# EAGLE design Adafruit-FONA-800-GSM-Breakout (EAGLE 7.5.0)
COMPANY: ADAFRUIT INDUSTRIES; DRAWN: KTOWN; REV: C

## Sheet 1 of 2
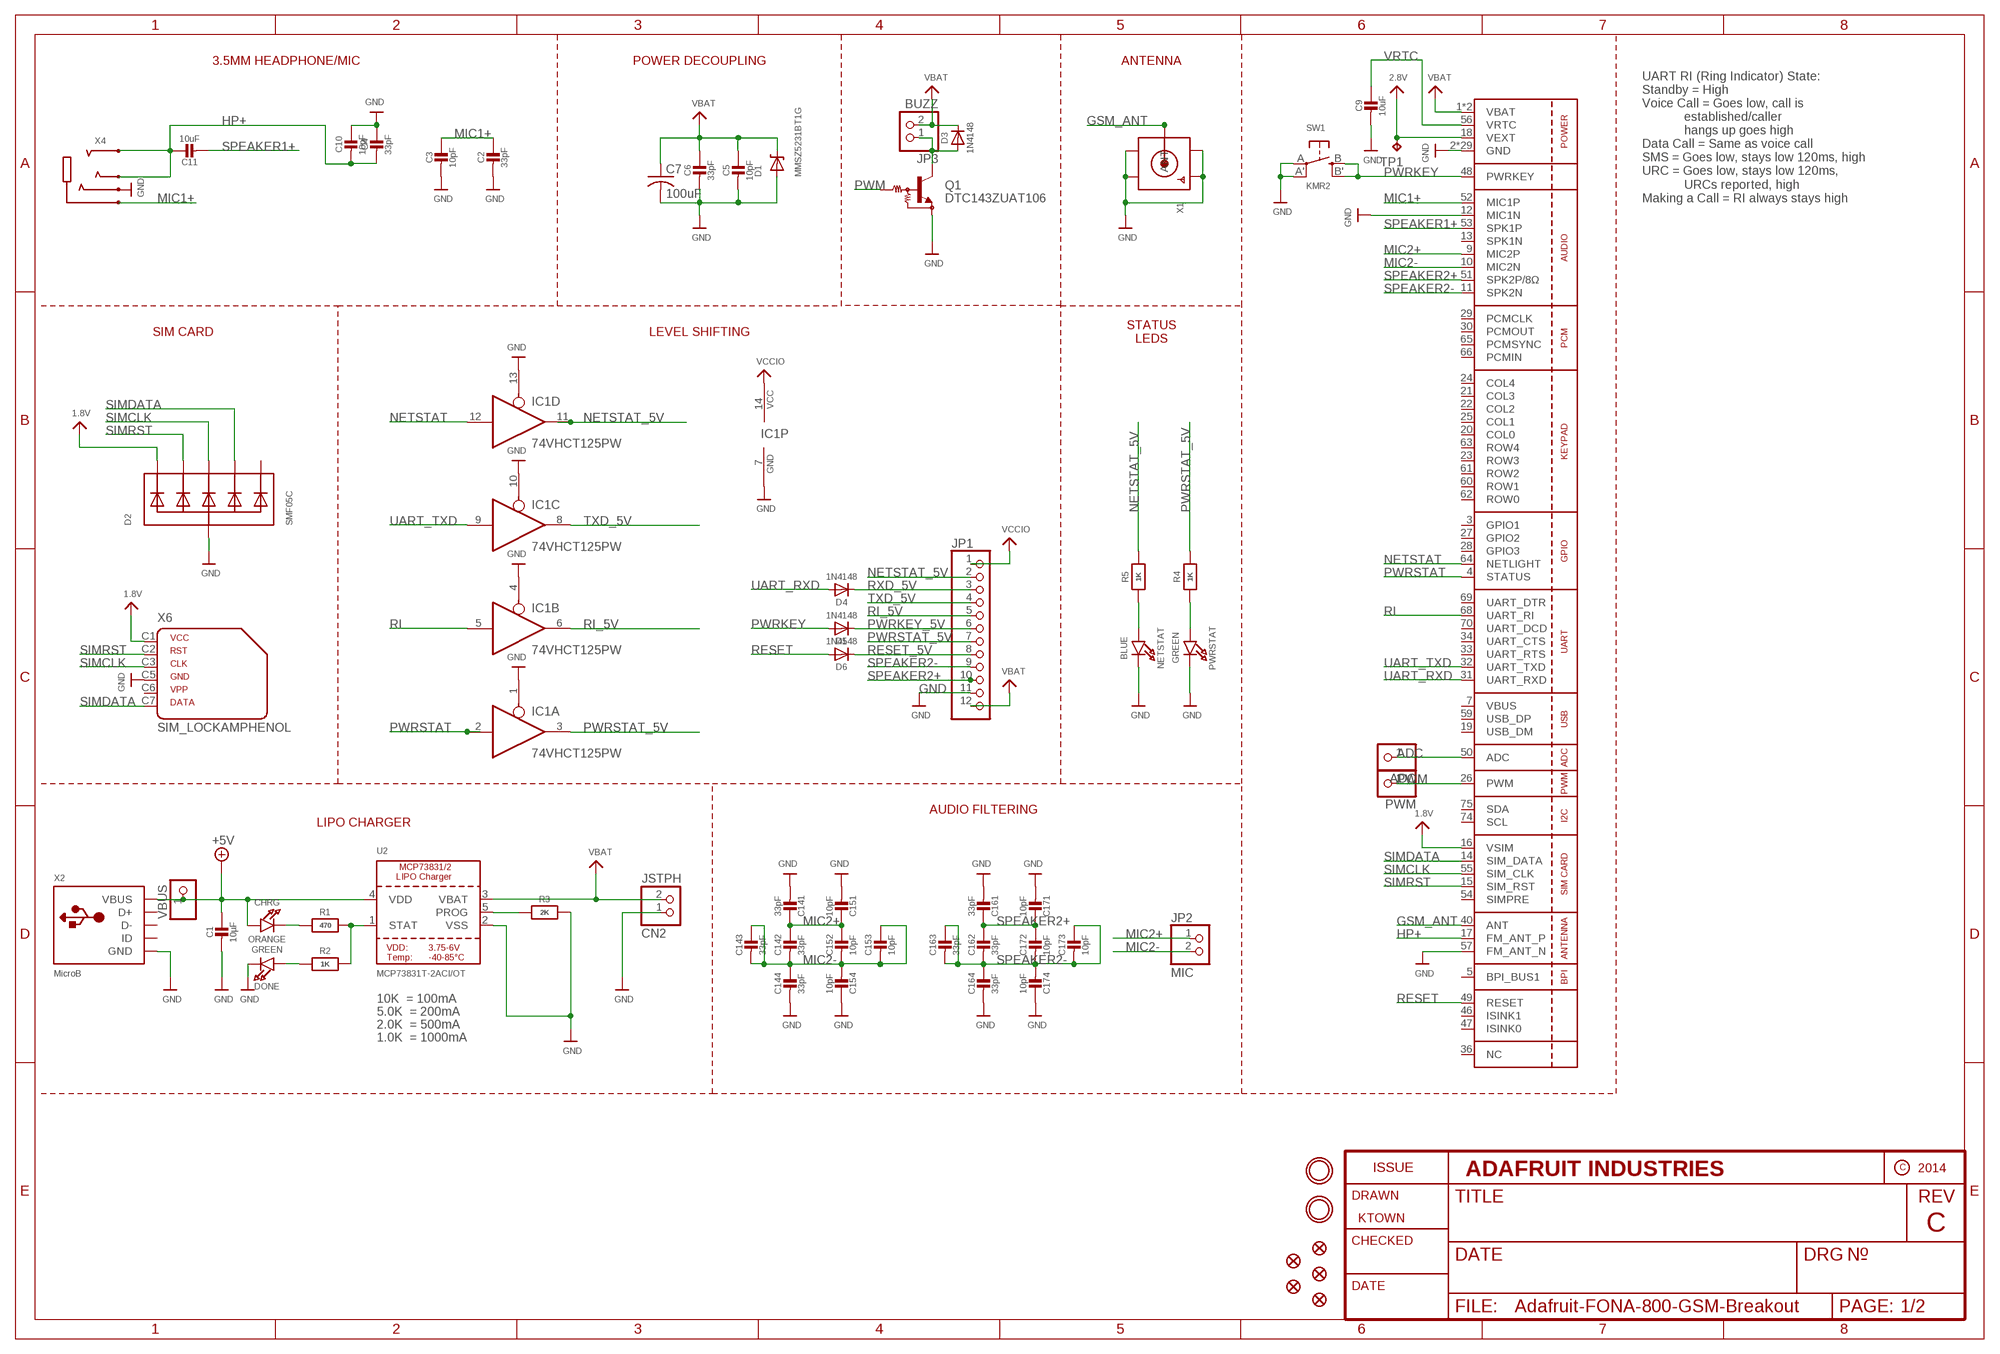
[diagram p0: schematic, sheet 1]

### Parts
ADC  PINHD-1X1CB  [1X01-CLEANBIG]
C1  10µF  CAP_CERAMIC0805-NOOUTLINE  [0805-NO]
C2  33pF  CAP_CERAMIC0805-NOOUTLINE  [0805-NO]
C3  10pF  CAP_CERAMIC0805-NOOUTLINE  [0805-NO]
C4  33pF  CAP_CERAMIC0805-NOOUTLINE  [0805-NO]
C5  10pF  CAP_CERAMIC0805-NOOUTLINE  [0805-NO]
C6  33pF  CAP_CERAMIC0805-NOOUTLINE  [0805-NO]
C7  100uF  C-USC1210  [C1210]
C9  10uF  CAP_CERAMIC0805-NOOUTLINE  [0805-NO]
C10  10pF  CAP_CERAMIC0805-NOOUTLINE  [0805-NO]
C11  10uF  CAP_CERAMIC0805-NOOUTLINE  [0805-NO]
C14  33pF  CAP_4PACK1206  [RESPACK_4X0603]
C15  10pF  CAP_4PACK1206  [RESPACK_4X0603]
C16  33pF  CAP_4PACK1206  [RESPACK_4X0603]
C17  10pF  CAP_4PACK1206  [RESPACK_4X0603]
CHRG  ORANGE  LED0805_NOOUTLINE  [CHIPLED_0805_NOOUTLINE]
CN2  JSTPH  JST_2PIN  [JSTPH2]
D1  MMSZ5231BT1G  DIODE-ZENERSOD123  [SOD-123]
D2  SMF05C  TVSARRAY_5LANE  [SOT363]
D3  1N4148  DIODESOD-323  [SOD-323]
D4  1N4148  DIODESOD-323  [SOD-323]
D5  1N4148  DIODESOD-323  [SOD-323]
D6  1N4148  DIODESOD-323  [SOD-323]
DONE  GREEN  LED0805_NOOUTLINE  [CHIPLED_0805_NOOUTLINE]
FID1  FIDUCIAL""  [FIDUCIAL_1MM]
FID2  FIDUCIAL""  [FIDUCIAL_1MM]
FID3  FIDUCIAL""  [FIDUCIAL_1MM]
FID4  FIDUCIAL""  [FIDUCIAL_1MM]
FID5  FIDUCIAL""  [FIDUCIAL_1MM]
IC1  74VHCT125PW  74ABT125PW  [TSSOP14]
JP1  PINHD-1X12-CB  [1X12-CB]
JP2  MIC  HEADER-1X2ROUND  [1X02_ROUND]
JP3  BUZZ  HEADER-1X2ROUND  [1X02_ROUND]
NETSTAT  BLUE  LED0805_NOOUTLINE  [CHIPLED_0805_NOOUTLINE]
PWM  PINHD-1X1CB  [1X01-CLEANBIG]
PWRSTAT  GREEN  LED0805_NOOUTLINE  [CHIPLED_0805_NOOUTLINE]
Q1  DTC143ZUAT106  MUN2211T1-NPN_DRIVER-SC59-BEC  [SC59-BEC]
R1  470  RESISTOR0805_NOOUTLINE  [0805-NO]
R2  1K  RESISTOR0805_NOOUTLINE  [0805-NO]
R3  2K  RESISTOR0805_NOOUTLINE  [0805-NO]
R4  1K  RESISTOR0805_NOOUTLINE  [0805-NO]
R5  1K  RESISTOR0805_NOOUTLINE  [0805-NO]
SW1  KMR2  SWITCH_TACT_SMT4.6X2.8  [BTN_KMR2_4.6X2.8]
TP1  TPTP11R  [TP11R]
U1  SIM800H/L  GSM_SIM800L  [SIM800L]
U2  MCP73831T-2ACI/OT  MCP73831/2  [SOT23-5]
U$33  MOUNTINGHOLE2.5  [MOUNTINGHOLE_2.5_PLATED]
U$34  MOUNTINGHOLE2.5  [MOUNTINGHOLE_2.5_PLATED]
VBUS  PINHD-1X1CB  [1X01-CLEANBIG]
X1  SMACONNECTOR_EDGE_UFL  [SMA_EDGELAUNCH_UFL]
X2  MicroB  USBMICRO_20329  [4UCONN_20329]
X4  AUDIO_3.5MMJACK_4POL  [4UCONN_18510]
X6  SIM_LOCKAMPHENOL  [C707_10M006_512_2]

### Nets
1.8V: D2.1(C1) U1.16(VSIM) X6.C1
2.8V: TP1.TP U1.18(VEXT)
+5V: C1.1 CHRG.A U2.4(VDD) VBUS.1 X2.VBUS
ADC: ADC.1 U1.50(ADC)
GND: C1.2 C2.2 C3.2 C4.1 C5.2 C6.2 C7.2 C9.2 C10.1 C14.5 C14.8 C15.4 C15.8 C16.5 C16.8 C17.4 C17.8 CN2.1 D1.A D2.2(A) DONE.C IC1.1(A:OE) IC1.4(B:OE) IC1.7(P:GND) IC1.10(C:OE) IC1.13(D:OE) JP1.11 NETSTAT.C PWRSTAT.C Q1.E R3.2 SW1.A'(P1) SW1.A(P) U1.2(GND) U1.6(GND) U1.8(GND) U1.12(MIC1N) U1.35(GND) U1.37(GND) U1.38(GND) U1.39(GND) U1.41(GND) U1.43(GND) U1.44(GND) U1.45(GND) U1.57(FM_ANT_N) U1.58(GND) U1.67(GND) U1.71(GND) U1.72(GND) U1.73(GND) U1.76(GND) U1.77(GND) U1.78(GND) U1.79(GND) U1.80(GND) U1.81(GND) U1.82(GND) U1.83(GND) U1.84(GND) U1.85(GND) U1.86(GND) U1.87(GND) U1.88(GND) U2.2(VSS) X1.GND@1(GND1) X1.GND@2(GND2) X1.GND@3(GND3) X1.GND@4(GND4) X2.BASE@1(GND) X2.BASE@2(GND) X2.GND X2.SPRT@1(GND) X2.SPRT@2(GND) X2.SPRT@3(GND) X2.SPRT@4(GND) X4.4-INNER_SLEEVE(RING1) X6.C5 ; also sheet 2
GSM_ANT: U1.40(ANT) X1.P(ANT)
HP+: C4.2 C10.2 C11.1 U1.17(FM_ANT_P) X4.2-TIP(RING3) X4.3-OUTER_SLEEVE(RING2)
MIC1+: C2.1 C3.1 U1.52(MIC1P) X4.1-GND(TIP)
MIC2+: C14.1 C14.2 C15.1 C15.2 JP2.1 U1.9(MIC2P)
MIC2-: C14.3 C14.4 C14.6 C14.7 C15.3 C15.5 C15.6 C15.7 JP2.2 U1.10(MIC2N)
N$1: CHRG.C R1.1
N$2: R1.2 R2.2 U2.1(STAT)
N$4: PWRSTAT.A R4.1
N$5: R3.1 U2.5(PROG)
N$6: DONE.A R2.1
N$9: NETSTAT.A R5.1
N$16: D3.A JP3.1 Q1.C
NETSTAT: IC1.12(D:I) U1.64(NETLIGHT)
NETSTAT_5V: IC1.11(D:O) JP1.2 R5.2
PWM: PWM.1 Q1.B U1.26(PWM)
PWRKEY: D5.A SW1.B'(S1) SW1.B(S) U1.48(PWRKEY)
PWRKEY_5V: D5.C JP1.6
PWRSTAT: IC1.2(A:I) U1.4(STATUS)
PWRSTAT_5V: IC1.3(A:O) JP1.7 R4.2
RESET: D6.A U1.49(RESET)
RESET_5V: D6.C JP1.8
RI: IC1.5(B:I) U1.68(UART_RI)
RI_5V: IC1.6(B:O) JP1.5
RXD_5V: D4.C JP1.3
SIMCLK: D2.4(C3) U1.55(SIM_CLK) X6.C3
SIMDATA: D2.5(C4) U1.14(SIM_DATA) X6.C7
SIMRST: D2.3(C2) U1.15(SIM_RST) X6.C2
SPEAKER1+: C11.2 U1.53(SPK1P)
SPEAKER2+: C16.1 C16.2 C17.1 C17.2 JP1.10 U1.51(SPK2P/8Ω)
SPEAKER2-: C16.3 C16.4 C16.6 C16.7 C17.3 C17.5 C17.6 C17.7 JP1.9 U1.11(SPK2N)
TXD_5V: IC1.8(C:O) JP1.4
UART_RXD: D4.A U1.31(UART_RXD)
UART_TXD: IC1.9(C:I) U1.32(UART_TXD)
VBAT: C5.1 C6.1 C7.1 CN2.2 D1.C D3.C JP1.12 JP3.2 U1.1(VBAT) U1.42(VBAT) U2.3(VBAT)
VCCIO: IC1.14(P:VCC) JP1.1
VRTC: C9.1 U1.56(VRTC)
Unconnected: D2.6(C5) U1.3(GPIO1) U1.5(BPI_BUS1) U1.13(SPK1N) U1.19(USB_DM) U1.20(COL0) U1.21(COL3) U1.22(COL2) U1.23(ROW3) U1.24(COL4) U1.25(COL1) U1.27(GPIO2) U1.28(GPIO3) U1.29(PCMCLK) U1.30(PCMOUT) U1.33(UART_RTS) U1.34(UART_CTS) U1.36(NC) U1.46(ISINK1) U1.47(ISINK0) U1.54(SIMPRE) U1.59(USB_DP) U1.60(ROW1) U1.61(ROW2) U1.62(ROW0) U1.63(ROW4) U1.65(PCMSYNC) U1.66(PCMIN) U1.69(UART_DTR) U1.70(UART_DCD) U1.74(SCL) U1.75(SDA) X2.D+ X2.D- X2.ID X6.C6

### Notes on the sheet
- 3.5MM HEADPHONE/MIC | POWER DECOUPLING | ANTENNA
- UART RI (Ring Indicator) State:
  Standby = High
  Voice Call = Goes low, call is 
              established/caller 
              hangs up goes high
  Data Call = Same as voice call
  SMS = Goes low, stays low 120ms, high
  URC = Goes low, stays low 120ms,
              URCs reported, high
  Making a Call = RI always stays high
- SIM CARD | LEVEL SHIFTING
- STATUS
  LEDS
- AUDIO FILTERING
- LIPO CHARGER
- 10K  = 100mA
- 5.0K  = 200mA
- 2.0K  = 500mA
- 1.0K  = 1000mA

## Sheet 2 of 2
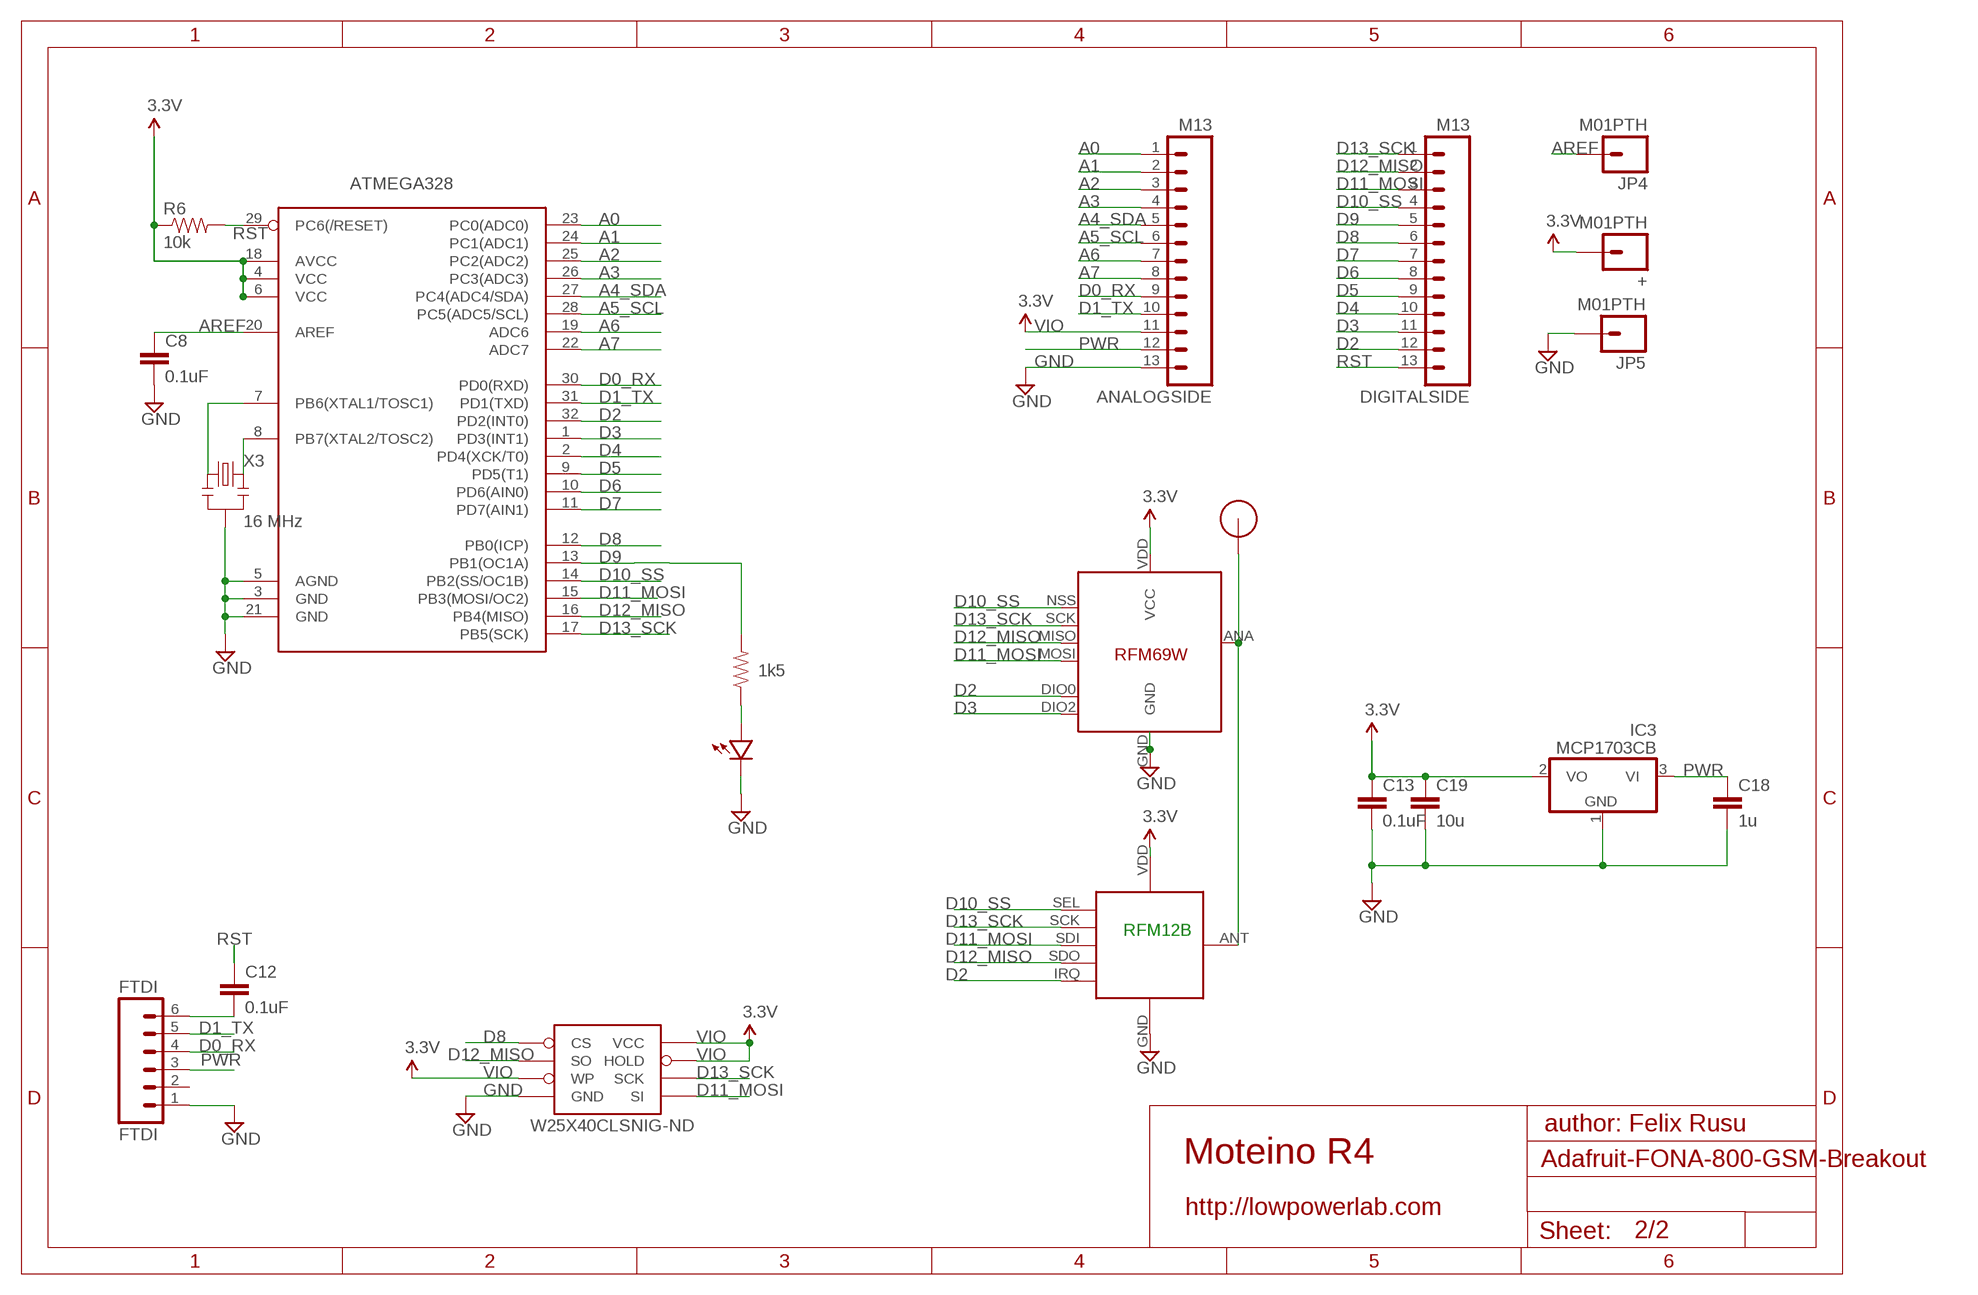
[diagram p1: schematic, sheet 2]

### Parts
+  M01PTH  [1X01]
ANALOGSIDE  M13  [1X13]
ATMEGA328  ATMega-328  ATMEGA168/328TQFP32  [TQFP32-08]
C8  0.1uF  CAP0603-CAP  [0603-CAP]
C12  0.1uF  CAP0603-CAP  [0603-CAP]
C13  0.1uF  CAP0603-CAP  [0603-CAP]
C18  1u  CAP0603-CAP  [0603-CAP]
C19  10u  CAP0805-CAP  [0805-CAP]
DIGITALSIDE  M13  [1X13]
FTDI  FTDI  M06SIP  [1X06]
IC3  MCP1703CB  [SOT23]
JP4  M01PTH  [1X01]
JP5  M01PTH  [1X01]
R6  10k  RESISTOR0603-RES  [0603-RES]
R7  1k5  RESISTOR0603-RES  [0603-RES]
RFM12B  RFM12B_MINPADS  [RFM12B-MINPADS]
U$38  LED0603  [0603-LED]
U$39  RFM12B_ANTENNA  [RFM12B-ANTENNA]
U$42  RFM69  [RFM69W-MINPADS]
W25X40CLSNIG-ND  AT25F512BWIDE_5.3MM  [SO08WIDE]
X3  16 MHz  RESONATORSMD  [RESONATOR-SMD]

### Nets
A0: ANALOGSIDE.1 ATMEGA328.23(PC0(ADC0))
A1: ANALOGSIDE.2 ATMEGA328.24(PC1(ADC1))
A2: ANALOGSIDE.3 ATMEGA328.25(PC2(ADC2))
A3: ANALOGSIDE.4 ATMEGA328.26(PC3(ADC3))
A4_SDA: ANALOGSIDE.5 ATMEGA328.27(PC4(ADC4/SDA))
A5_SCL: ANALOGSIDE.6 ATMEGA328.28(PC5(ADC5/SCL))
A6: ANALOGSIDE.7 ATMEGA328.19(ADC6)
A7: ANALOGSIDE.8 ATMEGA328.22(ADC7)
AREF: ATMEGA328.20(AREF) C8.1 JP4.1
D0_RX: ANALOGSIDE.9 ATMEGA328.30(PD0(RXD)) FTDI.4
D1_TX: ANALOGSIDE.10 ATMEGA328.31(PD1(TXD)) FTDI.5
D2: ATMEGA328.32(PD2(INT0)) DIGITALSIDE.12 RFM12B.IRQ U$42.DIO0
D3: ATMEGA328.1(PD3(INT1)) DIGITALSIDE.11 U$42.DIO2
D4: ATMEGA328.2(PD4(XCK/T0)) DIGITALSIDE.10
D5: ATMEGA328.9(PD5(T1)) DIGITALSIDE.9
D6: ATMEGA328.10(PD6(AIN0)) DIGITALSIDE.8
D7: ATMEGA328.11(PD7(AIN1)) DIGITALSIDE.7
D8: ATMEGA328.12(PB0(ICP)) DIGITALSIDE.6 W25X40CLSNIG-ND.1(CS)
D9: ATMEGA328.13(PB1(OC1A)) DIGITALSIDE.5 R7.2
D10_SS: ATMEGA328.14(PB2(SS/OC1B)) DIGITALSIDE.4 RFM12B.SEL U$42.NSS(SEL)
D11_MOSI: ATMEGA328.15(PB3(MOSI/OC2)) DIGITALSIDE.3 RFM12B.SDI(SDI/MOSI) U$42.MOSI W25X40CLSNIG-ND.5(SI)
D12_MISO: ATMEGA328.16(PB4(MISO)) DIGITALSIDE.2 RFM12B.SDO(SDO/MISO) U$42.MISO W25X40CLSNIG-ND.2(SO)
D13_SCK: ATMEGA328.17(PB5(SCK)) DIGITALSIDE.1 RFM12B.SCK U$42.SCK W25X40CLSNIG-ND.6(SCK)
GND: ANALOGSIDE.13 ATMEGA328.3(GND) ATMEGA328.5(AGND) ATMEGA328.21(GND) C8.2 C13.2 C18.2 C19.2 FTDI.1 IC3.1(GND) JP5.1 RFM12B.GND U$38.MINUS U$42.GND W25X40CLSNIG-ND.4(GND) X3.2 ; also sheet 1
N$3: ATMEGA328.7(PB6(XTAL1/TOSC1)) X3.1
N$7: R7.1 U$38.PLUS
N$8: RFM12B.ANT U$39.P$1 U$42.ANA(ANT)
N$20: C12.2 FTDI.6
N$21: ATMEGA328.8(PB7(XTAL2/TOSC2)) X3.3
PWR [power]: ANALOGSIDE.12 C18.1 FTDI.3 IC3.3(VI)
RST: ATMEGA328.29(PC6(/RESET)) C12.1 DIGITALSIDE.13 R6.2
VIO: +.1 ANALOGSIDE.11 ATMEGA328.4(VCC) ATMEGA328.6(VCC) ATMEGA328.18(AVCC) C13.1 C19.1 IC3.2(VO) R6.1 RFM12B.VDD U$42.VDD(VCC) W25X40CLSNIG-ND.3(WP) W25X40CLSNIG-ND.7(HOLD) W25X40CLSNIG-ND.8(VCC) ; supply symbol labelled 3.3V
Unconnected: FTDI.2

### Notes on the sheet
- RFM12B
- author: Felix Rusu
- Moteino R4
- http://lowpowerlab.com

## Power pins joined to a net without a drawn wire
VBUS: U1.7(VBUS)

## Library data of the parts
+ JP4 JP5 = SparkFun-Connectors:M01: Header 1 Standard 1-pin 0.1" header. Use with straight break away headers (SKU : PRT-00116), right angle break away headers (PRT-00553), swiss pins (PRT-00743), machine pins (PRT-00117), and female headers (PRT-00115).
ADC PWM VBUS = adafruit:PINHD-1X1: Pin header 1x1 for 0.1" spacing With round pins
ANALOGSIDE DIGITALSIDE = SparkFun-Connectors:M13: 13-pin single row .1" header
ATMEGA328 = LowPowerLab:ATMEGA168/328: Atmel 32-pin 8-bit micro, 16k flash.
C1-C6 C9-C11 = microbuilder:CAP_CERAMIC: Ceramic Capacitors For new designs, use the packages preceded by an '_' character since they are more reliable: The following footprints should be used on most boards: _0402 - Standard footprint for regular board layouts _0603 - Standard footprint for regular board layouts _0805 - Standard footprint for regular board layouts _1206 - Standard footprint for regular board layouts For extremely tight-pitch boards where space is at a premium, the following 'micro-pitch' footprints can be used (smaller pads, no silkscreen outline, etc.): _0402MP - Micro-pitch footprint for very dense/compact boards _0603MP - Micro-pitch footprint for very dense/compact boards _0805MP - Micro-pitch footprint for very dense/compact boards _1206MP - Micro-pitch footprint for very dense/compact boards
C7 = rcl:C-US: CAPACITOR, American symbol
C8 C12 C13 C18 C19 = LowPowerLab:CAP: Capacitor Standard 0603 ceramic capacitor, and 0.1" leaded capacitor.
C14-C17 = microbuilder:CAP_4PACK
CHRG DONE NETSTAT PWRSTAT = microbuilder:LED: LED 0603 - 0603 Surface Mount Package 2mA: Green LED - Low Power (3.9mcd, 2ma, 1.7Vf) - Digikey: 475-2709-2-ND Orange LED - Low Power (9.8mcd, 2ma, 1.8Vf) - Digikey: 475-1194-2-ND Red LED - Low Power (5mcd, 2ma, 1.8Vf) - Digikey: 475-1195-2-ND Yellow LED - Low Power (7mcd, 2ma, 1.8Vf) - Digikey: 475-1196-2-ND 5mA: Blue LED - Low Power (17mcd, 5ma, 2.9Vf) - Digikey: LNJ937W8CRACT-ND 0805 - 0805 Surface Mount Package 2mA: Red LED (8.8mcd, 2mA, 1.8Vf, Clear) - Low Power [Digikey: 475-2510-1-ND] Green LED (5mcd, 2mA, 1.8Vf, Clear) - Low Power [Digikey: 475-2730-1-ND] Yellow LED (11.3mcd, 2mA, 1.8Vf, Clear) - Low Power [Digikey: 475-2555-1-ND] 20mA: Red LED (104mcd, 20mA, Diffused) - LS R976 [Digikey: 475-1278-6-ND] Red LED (12mcd, 20mA, 2.0Vf, Clear) - APT2012EC [Digikey: 754-1128-1-ND] Green LED (15mcd, 20mA, 2.2Vf, Clear) - APT2012GC [Digikey: 754-1131-1-ND] Orange LED (160mcd, 20mA, 2.1Vf, Clear) - APT2012SECK [Digikey: 754-1130-1-ND] 1206 - 1206 Surface Mount Package Green LED (26mcd, 20mA, Diffused) - LG N971 [Digikey: 475-1407-6-ND] Red LED (15mcd, 20mA, Diffused) - LH N974 [Digikey: 475-1416-6-ND] Cree - Cree High-Power Surface Mount LEDs XPEBWT-L1-0000-00D50 - White 111lm 350mA 2.9Vf 6200K 110° XTEAWT-00-0000-00000LEE3 - White 114lm 350mA 2.85Vf 5000K 115° Everlight - Everlight 45-21 Series Surface Mount LEDs 45-21/QK2C-B2832AC2CB2/2T - Warm White 2000mcd 20mA 3.25Vf 3050K 120° 45-21/LK2C-B38452C4CB2/2T - Nuetral White 2000mcd 20mA 3.25Vf 4150K 120° 45-21/LK2C-B50634C6CB2/2T - Cold White 2200mcd 20mA 3.25Vf 5650K 120° PLCC2 Reverse Mount LS T77K-J1L2-1-0-2-R18-Z - Red 11.25mcd 2mA 1.8Vf 630nm 120° LO T77K-L1M2-24-Z - Orange 19.6mcd 2mA 1.8Vf 606nm 120° LY T77K-K2M1-26-Z - Yellow 15.7mcd 2mA 1.8Vf 587nm 120°
CN2 = microbuilder:JST_2PIN: JST 2-Pin Right-Angle Connector PH-Series - 4UConnector: 17311 SH-Series - 4UConnector: 07278
D1 = microbuilder:DIODE-ZENER: Zener Diode SMA: 30V 1W Zener Diode, 1.2Vf - Digikey: SMAZ30-FDICT-ND
D2 = microbuilder:TVSARRAY_5LANE: Voltage Transient Suppressor Array SOT363 SMF05C - 100W 5V: Digikey - SMF05CT1GOSCT-ND
D3-D6 = microbuilder:DIODE: Diode SMA Model Volts Amps Type Vf Ir Digikey # Notes SSA34-E3 40V 3A Schottky 480mV @ 3A 200uA @ 40V SSA34-E3/61TGITR-ND CDBA120-G 20V 1A Schottky 500mV @ 1A 500uA @ 20V 641-1014-6-ND REEL MBRA210 10V 2A Schottky 350mV @ 2A 700uA @ 10V MBRA210LT3 SOD-123 Model Volts Amps Type Vf Ir Order # Notes BAT54T1G 30V 200mA Schottky 800mV @ 200mA 2uA @ 25V BAT54T1GOSTR-ND B0530W 30V 500mA Schottky 430mV @ 500mA 130uA @ 30V B0530W-FDICT-ND REEL MBR120 20V 1A Schottky 340mV @ 1A MBR120VLSFT1GOSCT-ND SOD-323 Model Volts Amps Type Vf Ir Order # Notes PMEG2005EJ 20V 500mA Schottky 355mV @ 500mA 568-4110-1-ND ZLLS410 10V 570mA Schottky 380mV @ 570mA ZLLS410CT-ND 1N4148WS 75V 150mA Silicon/Simple 1V 1N4148WSFSCT-ND REEL SOD-523 Model Volts Amps Type Vf Ir Order # Notes BAT54XV2 30V 200mA Schottky 0.8V @ 100mA BAT54XV2CT-ND TB751S 30V 30mA Schottky RB751S-40TE61CT-ND SOT23-R/W (R = Solder Paste/Reflow Ovens, W = Hand-Soldering) Model Volts Amps Type Vf Ir Order # Notes BAT54FILM 40V 300mA Schottky 497-7162-1-ND POWERDI-5 Model Volts Amps Type Vf Ir Order # Notes PDS560 60V 5A Schottky 670mV @ 5A 150uA @ 60V PDS560DICT-ND
FID1-FID5 = microbuilder:FIDUCIAL: Fiducial Alignment Points Various fiducial points for machine vision alignment.; BOM: EXCLUDE
FTDI = SparkFun-Connectors:M06: Header 6 Standard 6-pin 0.1" header. Use with straight break away headers (SKU : PRT-00116), right angle break away headers (PRT-00553), swiss pins (PRT-00743), machine pins (PRT-00117), and female headers (PRT-00115). Molex polarized connector foot print use with SKU : PRT-08094 with associated crimp pins and housings. NOTES ON THE VARIANTS LOCK and LOCK_LONGPADS... This footprint was designed to help hold the alignment of a through-hole component (i.e. 6-pin header) while soldering it into place. You may notice that each hole has been shifted either up or down by 0.005 of an inch from it's more standard position (which is a perfectly straight line). This slight alteration caused the pins (the squares in the middle) to touch the edges of the holes. Because they are alternating, it causes a "brace" to hold the component in place. 0.005 has proven to be the perfect amount of "off-center" position when using our standard breakaway headers. Although looks a little odd when you look at the bare footprint, once you have a header in there, the alteration is very hard to notice. Also, if you push a header all the way into place, it is covered up entirely on the bottom side. This idea of altering the position of holes to aid alignment will be further integrated into the Sparkfun Library for other footprints. It can help hold any component with 3 or more connection pins.
IC1 = 74xx-us:74*125: Quad bus BUFFER, 3-state
IC3 = linear:MCP1703: 250 mA, 16V, Low Quiescent Current LDO Regulator Source: http://ww1.microchip.com/downloads/en/DeviceDoc/22049b.pdf
JP1 = adafruit2:PINHD-1X12: PIN HEADER
JP2 JP3 = microbuilder:HEADER-1X2: PIN HEADER
Q1 = transistor:*-NPN_DRIVER-: NPN Bias Resistor Transistor
R1-R5 = microbuilder:RESISTOR: Resistors For new designs, use the packages preceded by an '_' character since they are more reliable: The following footprints should be used on most boards: _0402 - Standard footprint for regular board layouts _0603 - Standard footprint for regular board layouts _0805 - Standard footprint for regular board layouts _1206 - Standard footprint for regular board layouts For extremely tight-pitch boards where space is at a premium, the following 'micro-pitch' footprints can be used (smaller pads, no silkscreen outline, etc.): _0402MP - Micro-pitch footprint for very dense/compact boards _0603MP - Micro-pitch footprint for very dense/compact boards _0805MP - Micro-pitch footprint for very dense/compact boards _1206MP - Micro-pitch footprint for very dense/compact boards
R6 R7 = LowPowerLab:RESISTOR: Resistor Basic schematic elements and footprints for 0603, 1206, and PTH resistors.
RFM12B = LowPowerLab:RFM12B_MINPADS
SW1 = microbuilder:SWITCH_TACT_SMT: SMT Tact Switches 6x6mm - Digikey: P12940SCT-ND KMR2 (4.6x2.8mm) - Digikey: 401-1426-1-ND EVQ-PQHB55 - Light Touch, 160GF (4.5x4.5mm) - Digikey: P8090SCT-ND KMT0 - KMT021 NGJ LHS (etc.) IP68/Waterproof - Digikey: CKN10289CT-ND
TP1 = testpad:TP: Test pad
U1 = microbuilder:GSM_SIM800L: SIM800K Quad-Band GSM/GPRS Module 850/900/1800/1900 MHz Bluetooth EDR (3.0) FM Band: 76-109MHz (50kHz steps) -40 - 85°C
U2 = microbuilder:MCP73831/2: MCP73831/2 LIPO Charger VDD: 3.75 - 6V Temp -40 - 85°C Programmable Charge Rate: 15-500mA NOTE: STAT is a tri-state logic output on the MCP73831 and an open-drain output on the MCP73832. SOT23-5 with 4.2V output and tri-state logic on STAT = MCP73831T-2ACI/OT
U$33 U$34 = microbuilder:MOUNTINGHOLE: Mounting Hole For #2 screws (0.086"/2.18mm width, 0.094"/2.4mm hole) use 2.5mm; BOM: EXCLUDE
U$38 = LowPowerLab:LED
U$39 = LowPowerLab:RFM12B_ANTENNA
U$42 = LowPowerLab:RFM69
W25X40CLSNIG-ND = LowPowerLab:AT25F512B: 4-Mbit SPI flash memory
X1 = microbuilder:SMACONNECTOR: SMA Connector 90° DIP SMA Connector, 50 Ohm (4UConnector: 07259)
X2 = microbuilder:USB: USB Connectors USBMINIB - Surface Mount Female Mini-B USB Connector 4UConnector: 06564
X3 = SparkFun:RESONATOR: Resonator Small SMD resonator. This is the itty bitty 10/20MHz resonators with built in caps. CSTCE10M0G55 and CSTCE20M0V53. Footprint has been reviewed closely but hasn't been tested yet.
X4 = microbuilder:AUDIO_3.5MMJACK_4POL: Footprint courtesy Morten Hjerde (Riftlabs.com) These are normally connected as follows (4-pin 3.5mm 'TRRS'), from left-to right on the schematic symbol above: Tip: Left Audio Outermost Ring: Right Audio Innermost Ring: Common/GND Shell: Mic+
X6 = microbuilder:SIM_LOCK: C707A SIMLOCK® 2.5 mm with wide solder tails Source: Data sheet <http://www.amphenol.info/downloads/C707_10M006_512_2.pdf>; OC_FARNELL: unknown; OC_NEWARK: unknown

## Net classes
1 power: width 0.381 mm, clearance 0.254 mm

## Board
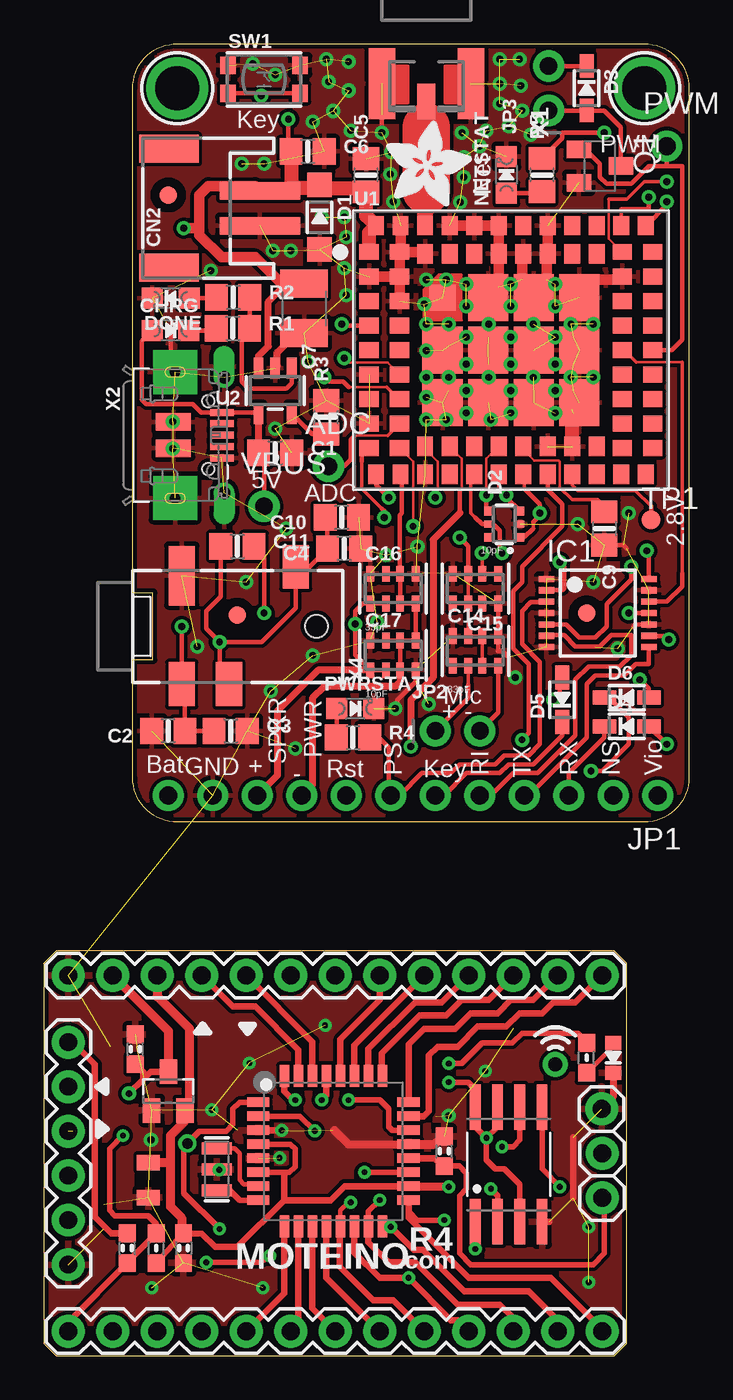
[diagram p2: board, top side]
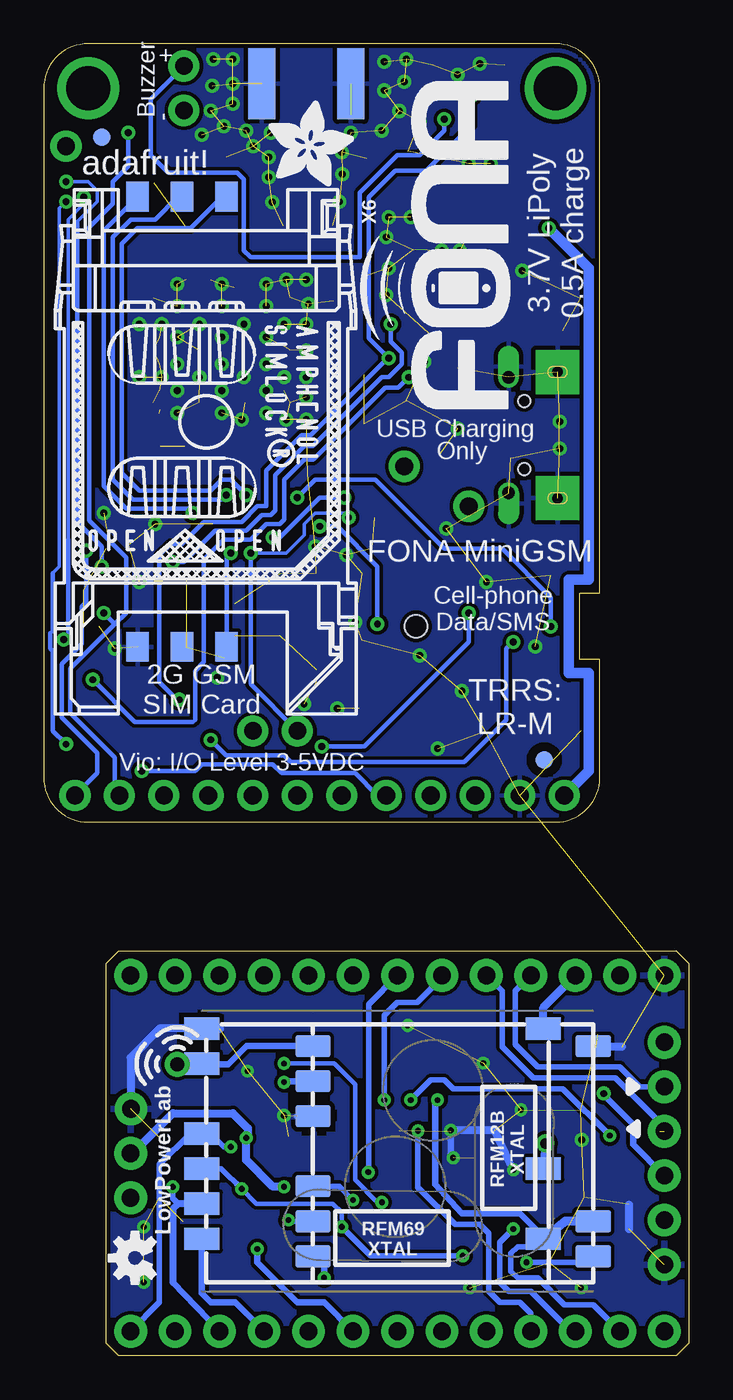
[diagram p3: board, bottom side, seen from below]

Size 36.83 x 74.93 mm. Coordinates in mm from the lower left corner, seen from the top.
Outline: 36.83,72.39 36.83,33.02 arc-90 34.29,30.48 7.62,30.48 arc-90 5.08,33.02 5.08,39.75 6.22,39.75 6.22,43.56 5.08,43.56 5.08,72.39 arc-90 7.62,74.93 34.29,74.93 arc-90 36.83,72.39
Outline: 0.71,0 32.56,0 33.27,0.71 33.27,22.4 32.56,23.11 0.71,23.11 0,22.4 0,0.71 0.71,0
Copper layers (1*16): Top 0.035mm / dielectric 1.5mm / Bottom 0.035mm
Design rules "adafruit *": minimum track width 6mil, minimum drill 15.5mil, track to track 8mil, track to pad 6mil, pad to pad 8mil, via to via 8mil, smd to smd 8mil, copper to edge 10mil, drill to drill 8mil, minimum pad ring 10mil, minimum via ring 8mil, stop-mask expansion 2mil, vias tented up to drill 20mil, thermal gap 10mil
tRestrict: area 21.2,52.8 to 21.3,59.7; area 24.9,62 to 25.4,62.2; area 27.8,62 to 28.2,62.2; area 21.3,52.7 to 29.6,52.8; area 31.9,53 to 32.3,61; area 22.6,62 to 23.1,62.2; area 21.1,60.7 to 21.3,61.2; area 24.3,8.9 to 29.1,12.8; area 5.8,16.9 to 6.9,18.5; area 5.2,9.7 to 6.7,10.4
bRestrict: area 27.4,17.7 to 29.2,18.7; area 21.1,13.8 to 22.9,14.9; area 21.6,12.6 to 22.1,13.2; area 20.7,12.6 to 21.2,13.2; area 20.2,12.8 to 20.7,13.5; area 20.1,13.4 to 20.6,14; area 26.5,18.9 to 27.1,19.5; area 26.5,17.9 to 27.1,18.5; area 27.5,19.1 to 28,19.8; area 27.9,18.8 to 29.1,19.6

### Footprints (pad centres in the part's own frame; a part is rotated, then mirrored left to right if it is on the bottom)
1X01 = drill 1.016 pad 1.88: 1 0,0
1X01-CLEANBIG = drill 1.016 pad 1.778: 1 0,0
1X13 = drill 1.016 pad 1.88: 1 0,0; 2 2.54,0; 3 5.08,0; 4 7.62,0; 5 10.16,0; 6 12.7,0; 7 15.24,0; 8 17.78,0; 9 20.32,0; 10 22.86,0; 11 25.4,0; 12 27.94,0; 13 30.48,0
TQFP32-08 = smd 1.27 x 0.533: 1 -4.293,2.8; 2 -4.293,2; 3 -4.293,1.2; 4 -4.293,0.4; 5 -4.293,-0.4; 6 -4.293,-1.2; 7 -4.293,-2; 8 -4.293,-2.8; 17 4.293,-2.8; 18 4.293,-2; 19 4.293,-1.2; 20 4.293,-0.4; 21 4.293,0.4; 22 4.293,1.2; 23 4.293,2; 24 4.293,2.8 | smd 0.533 x 1.27: 9 -2.8,-4.293; 10 -2,-4.293; 11 -1.2,-4.293; 12 -0.4,-4.293; 13 0.4,-4.293; 14 1.2,-4.293; 15 2,-4.293; 16 2.8,-4.293; 25 2.8,4.293; 26 2,4.293; 27 1.2,4.293; 28 0.4,4.293; 29 -0.4,4.293; 30 -1.2,4.293; 31 -2,4.293; 32 -2.8,4.293
0805-NO = smd 1.3 x 1.5: 1 -0.95,0; 2 0.95,0
C1210 = smd 1.6 x 2.7: 1 -1.4,0; 2 1.4,0
0603-CAP = smd 1.016 x 0.965: 1 -0.85,0; 2 0.85,0
RESPACK_4X0603 = smd 0.45 x 0.9: 1 -1.3,-0.85; 2 -0.4,-0.85; 3 0.4,-0.85; 4 1.3,-0.85; 5 1.3,0.85; 6 0.4,0.85; 7 -0.4,0.85; 8 -1.3,0.85
0805-CAP = smd 0.902 x 1.3: 1 -1,0; 2 1,0
CHIPLED_0805_NOOUTLINE = smd 1.2 x 1.2: A 0,-1.05; C 0,1.05
JSTPH2 = smd 1 x 4.6: 1 -1,-3.7; 2 1,-3.7 | smd 1.6 x 3.4: NC1 -3.4,1.5; NC2 3.4,1.5
SOD-123 = smd 1.4 x 1.4: A 1.85,0; C -1.85,0
SOT363 = smd 0.5 x 0.5: 1 -0.75,-0.9; 3 0.75,-0.9; 4 0.75,0.9; 6 -0.75,0.9 | smd 0.4 x 0.5: 2 0,-0.9; 5 0,0.9
SOD-323 = smd 1.35 x 0.8: A 1.27,0; C -1.27,0
FIDUCIAL_1MM = smd 1 x 1: 1 0,0
1X06 = drill 1.016 pad 1.88: 1 0,0; 2 2.54,0; 3 5.08,0; 4 7.62,0; 5 10.16,0; 6 12.7,0
TSSOP14 = smd 0.35 x 0.9: 1 -1.95,-2.925; 2 -1.3,-2.925; 3 -0.65,-2.925; 4 0,-2.925; 5 0.65,-2.925; 6 1.3,-2.925; 7 1.95,-2.925; 8 1.95,2.925; 9 1.3,2.925; 10 0.65,2.925; 11 0,2.925; 12 -0.65,2.925; 13 -1.3,2.925; 14 -1.95,2.925
SOT23 = smd 1 x 1.4: 1 -0.95,-1.1; 2 0.95,-1.1; 3 0,1.1
1X12-CB = drill 1.016 pad 1.778: 1 -13.97,0; 2 -11.43,0; 3 -8.89,0; 4 -6.35,0; 5 -3.81,0; 6 -1.27,0; 7 1.27,0; 8 3.81,0; 9 6.35,0; 10 8.89,0; 11 11.43,0; 12 13.97,0
1X02_ROUND = drill 1 pad 1.778: 1 -1.27,0; 2 1.27,0
SC59-BEC = smd 1 x 1.4: B -0.95,-1.2; C 0,1.2; E 0.95,-1.2
0603-RES = smd 1.016 x 0.965: 1 -0.85,0; 2 0.85,0
RFM12B-MINPADS = smd 2 x 1.27: ANT 8,-6; GND 8,-2; IRQ -8,4; SCK 8,4; SDI 8,2; SDI1 -8.002,-6.001; SDO -8,6; SEL 8,6; VDD 8,-4
BTN_KMR2_4.6X2.8 = smd 0.9 x 1: A 2.05,0.8; A' -2.05,0.8; B 2.05,-0.8; B' -2.05,-0.8
TP11R = smd 1.1 x 1.1: TP 0,0
SIM800L = smd 1.1 x 0.9: 1 -8.1,5.6; 2 -8.1,4.2; 3 -8.1,2.8; 4 -8.1,1.4; 5 -8.1,0; 6 -8.1,-1.4; 7 -8.1,-2.8; 8 -8.1,-4.2; 9 -8.1,-5.6; 22 8.1,-5.6; 23 8.1,-4.2; 24 8.1,-2.8; 25 8.1,-1.4; 26 8.1,0; 27 8.1,1.4; 28 8.1,2.8; 29 8.1,4.2; 30 8.1,5.6; 43 -6.36,5.6; 44 -6.36,4.2; 45 -6.36,2.8; 46 -6.36,1.4; 47 -6.36,0; 48 -6.36,-1.4; 49 -6.36,-2.8; 50 -6.36,-4.2; 51 -6.36,-5.6; 60 6.36,-5.6; 61 6.36,-4.2; 62 6.36,-2.8; 63 6.36,-1.4; 64 6.36,0; 65 6.36,1.4; 66 6.36,2.8; 67 6.36,4.2; 68 6.36,5.6 | smd 0.9 x 1.1: 10 -7.7,-7.1; 11 -6.3,-7.1; 12 -4.9,-7.1; 13 -3.5,-7.1; 14 -2.1,-7.1; 15 -0.7,-7.1; 16 0.7,-7.1; 17 2.1,-7.1; 18 3.5,-7.1; 19 4.9,-7.1; 20 6.3,-7.1; 21 7.7,-7.1; 31 7.7,7.1; 32 6.3,7.1; 33 4.9,7.1; 34 3.5,7.1; 35 2.1,7.1; 36 0.7,7.1; 37 -0.7,7.1; 38 -2.1,7.1; 39 -3.5,7.1; 40 -4.9,7.1; 41 -6.3,7.1; 42 -7.7,7.1; 52 -4.9,-5.5; 53 -3.5,-5.5; 54 -2.1,-5.5; 55 -0.7,-5.5; 56 0.7,-5.5; 57 2.1,-5.5; 58 3.5,-5.5; 59 4.9,-5.5; 69 4.9,5.5; 70 3.5,5.5; 71 2.1,5.5; 72 0.7,5.5; 73 -0.7,5.5; 74 -2.1,5.5; 75 -3.5,5.5; 76 -4.9,5.5 | smd 1.5 x 1.5: 77 -3.9,3 | smd 2.3 x 2.7: 78 -3.9,0; 79 -3.9,-3; 80 -1.3,-3; 81 1.3,-3; 82 3.9,-3; 83 3.9,0; 84 3.9,3; 85 1.3,3; 86 -1.3,3; 87 -1.3,0; 88 1.3,0
SOT23-5 = smd 0.55 x 1.2: 1 -0.95,-1.3; 2 0,-1.3; 3 0.95,-1.3; 4 0.95,1.3; 5 -0.95,1.3
MOUNTINGHOLE_2.5_PLATED = drill 2.5 pad 3.2: P$1 0,0
0603-LED = smd 0.8 x 0.9: MINUS -0.85,0; PLUS 0.85,0
RFM12B-ANTENNA = drill 0.8 pad 1.422: P$1 0,0
RFM69W-MINPADS = smd 2 x 1.27: ANA 8,-5; DIO0 -11.5,5; DIO2 -11.5,1; GND 8,-7; MISO 8,1; MOSI 8,3; NSS 8,5; SCK 8,-1; VDD -11.5,-7
SO08WIDE = smd 0.61 x 2.6: 1 -1.905,-3.269; 2 -0.635,-3.269; 3 0.635,-3.269; 4 1.905,-3.269; 5 1.905,3.286; 6 0.635,3.286; 7 -0.635,3.286; 8 -1.905,3.286
SMA_EDGELAUNCH_UFL = smd 4.064 x 1.524: GND@1 2.032,-2.54; GND@2 2.032,2.54 | smd 4.064 x 1.524 bottom: GND@3 2.032,2.54; GND@4 2.032,-2.54 | smd 2.032 x 1.016: P 3.048,0
4UCONN_20329 = smd 1 x 2: BASE@1 -0.75,-2; BASE@2 0.75,-2 | smd 0.4 x 1.35: D+ 0,0.775; D- -0.65,0.775; GND 1.3,0.775; ID 0.65,0.775; VBUS -1.3,0.775 | drill 0.7 offset: SPRT@1 -3.3,0.9; SPRT@2 3.3,0.9 | drill 0.6 pad 2.5 square: SPRT@3 -3.6,-1.9; SPRT@4 3.6,-1.9 | hole 0.7: -1.95,0; 1.95,0
RESONATOR-SMD = smd 0.7 x 1.7: 1 -1.2,0; 2 0,0; 3 1.2,0
4UCONN_18510 = smd 1.5 x 2.5: 1-GND 2.8,-3.3; 2-TIP 9.3,3.4; 3-OUTER_SLEEVE 5.5,-3.3 | smd 1.5 x 3.4: 4-INNER_SLEEVE 2.8,2.9 | hole 1.3: 10.5,0
C707_10M006_512_2 = smd 1.7 x 1.3: C1 -12.85,-3.915; C2 -12.85,-1.375; C3 -12.85,1.165; C5 12.85,-3.915; C6 12.85,-1.375; C7 12.85,1.165

### Placement (x,y rotation side)
+  31.88,11.56 270 top
ADC  16.26,50.8 0 top
ANALOGSIDE  31.88,21.72 180 top
ATMEGA328  16.54,11.68 0 top
C1  13.21,51.56 0 top
C2  7.11,35.69 180 top
C3  10.67,35.69 0 top
C4  17.14,46.1 180 top
C5  18.4,67.42 90 top
C6  15.07,68.79 0 top
C7  14.86,59.82 270 top
C8  22.86,11.68 90 top
C9  32,47.24 270 top
C10  17.02,47.88 180 top
C11  11.05,46.23 0 top
C12  4.78,6.15 90 top
C13  7.98,6.15 270 top
C14  24.64,40.26 0 top
C15  24.64,43.81 180 top
C16  19.94,43.81 0 top
C17  19.94,40.01 0 top
C18  5.23,17.5 90 top
C19  5.97,10.03 270 top
CHRG  7.24,58.56 270 top
CN2  8.64,65.53 90 top
D1  15.75,65.02 270 top
D2  26.29,47.5 90 top
D3  30.99,72.39 270 top
D4  33.27,35.94 0 top
D5  29.59,37.47 90 top
D6  33.27,37.59 0 top
DIGITALSIDE  31.88,1.4 180 top
DONE  7.25,60.41 90 top
FID1  11.05,42.29 0 top
FID2  7.11,66.29 0 top
FID3  30.99,42.42 0 top
FID4  33.53,69.6 0 bottom
FID5  8.25,34.04 0 bottom
FTDI  1.4,5.21 90 top
IC1  31.62,42.42 270 top
IC3  7.11,15.11 0 top
JP1  21.08,32 180 top
JP2  23.62,35.69 0 top
JP3  28.83,72.39 90 top
JP4  31.88,9.02 0 top
JP5  31.85,14.1 0 top
NETSTAT  26.42,67.44 0 top
PWM  35.56,69.09 0 top
PWRSTAT  17.78,36.96 270 top
Q1  31.75,67.95 270 top
R1  10.79,58.67 0 top
R2  10.81,60.45 0 top
R3  16.13,53.59 90 top
R4  17.65,35.31 0 top
R5  28.45,67.44 90 top
R6  6.43,6.15 90 top
R7  30.99,17.02 90 top
RFM12B  13.46,11.68 180 bottom
SW1  12.57,72.9 0 top
TP1  34.67,47.75 0 top
U1  26.67,57.44 0 top
U2  13.21,55.12 180 top
U$10  [ADAFRUIT_5MM]  19.56,65.66 0 top
U$26  [FONA_LOGO]  10.03,53.59 90 bottom
U$33  34.29,72.39 90 top
U$34  7.62,72.39 90 top
U$36  [ADAFRUIT_5MM]  24,66.8 0 bottom
U$38  32.51,17.02 90 top
U$39  29.21,16.64 0 top
U$42  19.81,11.68 180 bottom
U$43  [OSHW-LOGO-S]  31.62,5.59 90 bottom
VBUS  12.57,48.51 0 top
W25X40CLSNIG-ND  26.54,10.92 0 top
X1  21.84,74.68 270 top
X2  9.4,52.58 270 top
X3  9.88,10.64 270 top
X4  5.08,41.66 0 top
X6  27.56,53.34 270 bottom

### Tracks (layer width: path | path; a pad name or v marks a point on that pad's centre or on a via)
1.8V  (via drill 0.39)
  Top 0.203: 27.94,47.24 27.94,47.62 | 27.43,49.53 27.43,50.27 U1.16
  Top 0.254: 27.43,49.53 28.32,48.64 v28.32,48.13 28.32,48.01 27.94,47.62 | 27.94,47.24 27.44,46.75 D2.1
  Bottom 0.254: X6.C1 33.4,64.26 33.4,49.66 32.13,48.39 28.07,48.39 v28.32,48.13
2.8V
  Top 0.203: U1.18 30.17,49.71 30.48,49.4 33.78,49.4 34.67,48.51
  Top 0.254: 34.67,48.51 TP1.TP
+5V
  Top 0.254: CHRG.A 5.59,57.96 5.59,54.61 5.84,54.36 8.51,54.36 8.99,53.88 X2.VBUS 12.2,53.88 U2.4 | C1.1 12.57,51.25 VBUS.1
  Top 0.406: U2.4 C1.1
A0
  Top 0.381: ATMEGA328.23 21.69,13.68 21.97,13.97 21.97,17.14 22.48,17.65 23.62,17.65 24.77,18.8 26.42,18.8 27.18,19.56 28.45,19.56 29.08,20.19 30.35,20.19 ANALOGSIDE.1
A1
  Top 0.381: ATMEGA328.24 20.83,17.78 21.72,18.67 23.49,18.67 24.38,19.56 25.91,19.56 26.67,20.32 27.94,20.32 ANALOGSIDE.2
A2
  Top 0.381: ATMEGA328.25 19.3,15.98 19.3,17.27 21.46,19.43 22.99,19.43 23.88,20.32 25.4,20.32 ANALOGSIDE.3
A3
  Top 0.381: ATMEGA328.26 18.54,17.52 21.21,20.19 22.73,20.19 ANALOGSIDE.4
A4_SDA
  Top 0.381: ATMEGA328.27 17.73,17.73 ANALOGSIDE.5
A5_SCL
  Top 0.381: ATMEGA328.28 16.94,18.08 19.18,20.32 ANALOGSIDE.6
A6  (via drill 0.33)
  Top 0.305: ATMEGA328.19 v18.31,10.48
  Bottom 0.305: 18.29,10.41 18.29,20.07 ANALOGSIDE.7
  Bottom 0.381: 18.29,10.41 v18.31,10.48
A7  (via drill 0.33)
  Top 0.305: ATMEGA328.22 19.88,12.88 19.69,13.08 19.69,14.1 19.18,14.61 v17.4,14.61
  Bottom 0.305: v17.4,14.61 17.4,19.43 16.64,20.19 15.49,20.19 14.1,21.59 ANALOGSIDE.8
ADC
  Top 0.152: 19.63,52.54 17.76,52.54
  Top 0.203: 19.63,52.54 20.31,53.22 U1.50
  Top 0.254: 17.76,52.54 17.53,52.31 17.53,51.18 17.14,50.8 ADC.1
AREF
  Top 0.305: C8.1 23.71,10.83 24.13,10.41 24.13,9.53 23.75,9.14 23.75,5.84 24.38,5.21 31.37,5.21 32,5.84 32,8.89 JP4.1
  Top 0.381: ATMEGA328.20 22.28,11.28 C8.1
D0_RX  (1 unrouted)
  Top 0.381: ATMEGA328.30 15.34,17.94 ANALOGSIDE.9
  Bottom 0.305: 1.65,12.83 1.65,13.34 4.19,15.88 8.89,15.88 10.67,17.65 10.67,20.83 ANALOGSIDE.9
D1_TX
  Top 0.381: ATMEGA328.31 14.54,17.47 12.07,19.94 10.79,19.94 ANALOGSIDE.10
  Bottom 0.305: FTDI.5 2.79,15.37 3.94,16.51 8.64,16.51 9.91,17.78 9.91,20.83 ANALOGSIDE.10
D2  (via drill 0.33)
  Top 0.381: v14.35,14.61 14.22,14.61 13.72,15.11 13.72,15.83 ATMEGA328.32
  Bottom 0.305: DIGITALSIDE.12 5.46,2.92 7.11,2.92 8.64,4.45 9.78,4.45 10.16,4.83 10.16,5.84 9.78,6.22 8.77,6.22 U$42.DIO0
  Bottom 0.381: 7.85,6.89 8.41,6.89 9.65,8.13 12.95,8.13 14.48,9.78 14.48,14.35 v14.35,14.61
  Bottom 0.406: U$42.DIO0 8.05,6.68 7.85,6.89
  Bottom 0.508: RFM12B.IRQ 7.06,7.68 U$42.DIO0
D3  (via drill 0.33, 0.6)
  Top 0.305: v10.03,7.24 8,9.27 8,11.94 v8.19,12.13 | 8.2,12.14 8.89,12.83 10.41,12.83 10.79,13.21 10.79,14.1 11.18,14.48 ATMEGA328.1
  Top 0.381: ATMEGA328.1
  Top 0.406: v8.19,12.13 8.2,12.14
  Bottom 0.305: DIGITALSIDE.11 6.73,1.4 9.02,3.68 10.29,3.68 10.79,4.19 10.79,6.48 v10.03,7.24
  Bottom 0.406: U$42.DIO2 v8.19,12.13
D4  (via drill 0.33)
  Top 0.305: ATMEGA328.2 14.63,13.68 v15.46,12.85
  Top 0.381: 12.17,13.73 ATMEGA328.2
  Bottom 0.305: DIGITALSIDE.10 9.02,2.41 9.65,3.05 10.79,3.05 11.43,3.68 11.43,6.98 11.94,7.49 13.34,7.49 15.46,9.62 v15.46,12.85
D5
  Top 0.381: ATMEGA328.9 13.73,3.57 DIGITALSIDE.9
D6
  Top 0.381: DIGITALSIDE.8 14.54,1.84 ATMEGA328.10
D7
  Top 0.381: ATMEGA328.11 15.34,2.7 DIGITALSIDE.7
D8  (via drill 0.33)
  Top 0.305: v24.64,6.1 24.62,7.75 W25X40CLSNIG-ND.1
  Top 0.381: ATMEGA328.12 16.13,4.44 DIGITALSIDE.6
  Bottom 0.381: v24.64,6.1 24.64,5.33 22.35,3.05 20.83,3.05 DIGITALSIDE.6
D9  (via drill 0.33)
  Top 0.254: ATMEGA328.13 16.94,8.3 17.4,8.76 v17.53,8.76
  Top 0.305: R7.2 30.77,18.12 30.48,18.41 27.3,18.41 26.75,17.86 25.04,17.86 23.88,16.69 v23.11,16.69
  Top 0.381: ATMEGA328.13 16.89,7.31 16.89,5.08 18.8,3.18 19.94,3.18 DIGITALSIDE.5
  Bottom 0.254: v17.53,8.76 17.78,8.76 19.05,10.03 19.05,15.49 20.24,16.69 v23.11,16.69
D10_SS  (via drill 0.33)
  Top 0.381: ATMEGA328.14 17.73,5.89 19.18,4.45 v20.83,4.45 23.24,2.03 23.62,2.03 DIGITALSIDE.4
  Bottom 0.254: 20.83,5.43 RFM12B.SEL
  Bottom 0.381: v20.83,4.45 20.83,5.43 | U$42.NSS 27.81,3.55 27.3,3.05 25.91,3.05 DIGITALSIDE.4
D11_MOSI  (via drill 0.33)
  Top 0.305: v29.46,9.65 28.45,10.67 W25X40CLSNIG-ND.5 | ATMEGA328.15 18.54,8.25 v19.18,8.89
  Top 0.381: ATMEGA328.15 18.54,6.48 19.69,5.33 21.21,5.33 23.62,2.92 26.03,2.92 26.8,2.16 DIGITALSIDE.3
  Bottom 0.305: v29.46,9.65 29.46,8.99 29.16,8.68 | v19.18,8.89 19.97,9.68 RFM12B.SDI
  Bottom 0.381: DIGITALSIDE.3 29.46,4.19
  Bottom 0.406: U$42.MOSI 29.16,8.68 29.46,8.38 29.46,4.19
D12_MISO  (via drill 0.33)
  Top 0.305: v25.53,9.53 25.91,9.14 25.91,8.51 W25X40CLSNIG-ND.2 | v9.27,5.33 12.39,5.33 v12.9,5.71
  Top 0.381: ATMEGA328.16 19.91,7.39 v19.81,7.37 21.12,6.06 21.63,6.06 24,3.68 27.69,3.68 29.34,2.03 DIGITALSIDE.2
  Bottom 0.254: v25.53,9.53 24.69,8.69 20.32,8.69 19.81,8.18 v19.81,7.37
  Bottom 0.305: U$42.MISO 26.69,10.68 v25.53,9.53 25.84,9.84 | v19.81,7.37 18.16,5.71 v12.9,5.71 | v9.27,5.33 5.81,5.33 RFM12B.SDO
D13_SCK  (via drill 0.33)
  Top 0.305: v26.16,11.94 26.8,11.94 27.18,12.32 W25X40CLSNIG-ND.6 | v22.86,7.75 21.34,7.75 20.83,8.25
  Top 0.381: DIGITALSIDE.1 31.88,1.52 28.96,4.45 24.25,4.45 20.83,7.87 20.83,8.25 ATMEGA328.17
  Bottom 0.305: RFM12B.SCK 22.8,7.68 v22.86,7.75 | DIGITALSIDE.1 30.23,3.05 30.23,10.92 28.46,12.68 U$42.SCK 27.8,12.7 27.3,12.7 26.54,11.94 v26.16,11.94
GND  (via drill 0.33, 0.38, 0.39, 0.41)  (167 unrouted)
  Top 0.254: v24.13,61.21 25.37,61.21 U1.86 | v26.67,61.21 27.97,61.21 | v29.21,61.21 27.97,61.21 | 27.97,61.21 U1.85 | v25.4,58.93 25.4,58.17 v24.13,58.17 | v26.67,58.17 v29.21,58.17 30.23,58.17 | v21.84,55.88 v21.84,58.93 23.11,57.66 v23.11,55.88 | v23.11,55.88 23.11,56.64 v24.13,56.64 | v25.4,55.88 25.4,56.64 v26.67,56.64 | v23.11,55.88 23.11,55.12 v24.13,55.12 v26.67,55.12 v29.21,55.12 30.23,55.12 | v24.13,53.85 v26.67,53.85 v29.21,53.85 30.23,53.85 | 30.23,56.64 v29.21,56.64 | 31.24,61.47 31.24,60.44 U1.84 | X2.SPRT@3 7.24,56.18 7.24,58.55 | C15.8 C14.5 25.94,40.29 25.91,40.26 26.16,40.26 26.54,39.88 26.54,39.12 v26.92,38.73 | 33.27,46.1 33.08,46.29 C9.2 | C16.5 21.28,44.7 | 20.19,36.83 v20.07,36.96 20.19,37.08 20.19,37.47 21.24,38.51 C17.4 | v19.3,69.85 19.3,70.87 | IC1.10 33.77,41.77 33.66,41.66
  Top 0.381: 20.94,12.07 ATMEGA328.21 | v13.59,12.88 ATMEGA328.3 | 16.53,12.88 16.59,12.88 | W25X40CLSNIG-ND.4 28.86,7.65 | 30.23,9.02 30.23,12.47 | v10.01,10.62 X3.2
  Top 0.406: U2.2 13.34,56.55 13.34,57.28 14.47,58.42 C7.2 | U$38.MINUS 32.51,14.76 JP5.1
  Top 0.457: 20.94,12.07 17.4,12.07 16.59,12.88
  Top 0.508: ATMEGA328.21 22.28,12.08 C8.2 22.99,12.41
  Top 0.61: U1.86 25.97,61.04 U1.73 U1.37 U1.38 U1.39 | U1.76 21.67,63.04 U1.43 | U1.43 20.37,63.1 U1.41 | U1.43 U1.44 | U1.44 U1.2 | U1.44 U1.45 | U1.67 32.86,61.47 31.24,61.47 | U1.35 U1.71 28.7,62.87 28.7,61.47 | U1.72 27.3,62.87 27.3,61.47
  Top 0.813: U1.58 30.17,54.04 U1.82
  Bottom 0.381: 13.59,12.81 v13.59,12.88 13.59,11.3 v13.46,11.3 | RFM12B.GND 22.38,13.68
  Bottom 0.457: 26.81,18.68 30.21,18.68 31.88,17.02 31.88,14.12 JP5.1 | v10.01,10.62 11.08,12.88 v13.59,12.88 | 3.43,8.64 3.43,7.24 | 3.81,17.65 5.31,17.65
  Bottom 0.508: U$42.GND 26.81,18.68 | 10.02,10.6 v10.01,10.62
  other vias: 23.11,58.93 24.13,59.94 26.67,59.94 29.21,59.94 30.1,58.93 31.37,58.93 31.37,55.88 30.1,55.88 27.94,58.93 27.94,55.88 21.84,57.4 21.84,54.74 21.84,53.47 22.99,53.47 25.53,53.47 22.99,61.47 21.72,60.07 21.84,61.47 13.21,52.96 23.79,65.89 24.88,69.09 27.16,74.06 27.22,72.54 26.03,72.64 16.13,74.04 17.4,73.91 16.26,72.77 16.54,71.09 19.83,68.73 19.79,67.48 19.95,65.91 23.99,68.45 23.99,67.31 26.03,71.5 26.03,74.04 7.37,53.34 7.37,51.82 13.08,63.12 23.88,69.85 8.76,40.51 15.88,65.02 15.37,70.48 17.14,62.1 17.27,63.88 14.1,63.12 17.27,60.58 17.14,65.02 11.3,68.07 12.57,68.07 19.05,41.91 15.37,40.01 11.56,44.2 13.84,47.24 12.95,37.97 21.97,37.21 14.35,34.67 30.48,47.5 33.4,48.13 11.94,73.79 17.4,72.26 27.3,71.12 26.54,70.23 27.81,69.72 25.27,69.98 17.53,69.98 9.53,61.98 13.21,73.15 32.77,40.39 19.56,45.72 21.34,46.23 31.37,44.2 15.11,56.77 6.12,12.32 23.11,13.72 6.15,3.89 12.5,3.89 9.58,14.05 11.74,16.71 16.06,18.87 25.2,16.26 31.12,7.37 31.12,4.19
  pour Top: 5.08,74.8 4.95,30.23 36.83,30.23 36.96,74.8
  pour Bottom: 5.08,74.8 4.95,30.48 36.83,30.48 36.96,74.8
  pour Bottom: -0.63,24 -0.63,-0.76 34.04,-0.76 34.04,24
  pour Top: -0.63,24 -0.63,-0.76 34.04,-0.76 34.04,24
GSM_ANT
  Top 0.254: 21.84,67.58 21.85,67.58 | X1.P 21.85,70.99 | 21.77,66.5 21.85,66.43 21.85,66.42
  Top 0.305: 21.85,66.55 21.85,66.42 21.85,66.3
  Top 0.406: 21.85,70.99 21.85,69.85
  Top 0.9: U1.40 21.77,66.5
  Top 2.7: 21.85,66.55 21.85,67.58 21.85,69.85 21.85,70.16 21.84,70.17
HP+  (via drill 0.39)
  Top 0.254: U1.17 28.77,49.46 29.59,48.64 29.59,47.37 27.3,45.09 27.3,44.2 26.8,43.69 26.8,40.39 27.69,39.5 27.69,35.56 v27.3,35.18 | v10.03,40.77 10.03,38.9 X4.3-OUTER_SLEEVE | C11.1 10.1,43.37 9.27,42.55 9.27,41.53 v10.03,40.77 | C10.2 16.2,47.75 C4.2 15.15,45.06 X4.2-TIP 14.38,42.7 12.45,40.77 v10.03,40.77
  Bottom 0.254: v10.03,40.77 10.41,40.39 10.41,36.32 12.83,33.91 22.73,33.91 23.11,34.29 26.42,34.29 v27.3,35.18
MIC1+  (via drill 0.39)
  Top 0.152: 21.77,51.76 22.48,51.05 22.48,49.4 22.35,49.28 v22.35,49.02
  Top 0.254: U1.52 21.77,51.76 | C3.1 C2.1 8.06,38.43 7.95,38.43 X4.1-GND v7.88,41.65 v7.87,41.66
  Bottom 0.254: v22.35,49.02 21.34,50.04 17.91,50.04 13.97,46.1 10.67,46.1 7.87,43.31 v7.87,41.66
MIC2+  (via drill 0.39)
  Top 0.203: 18.16,51.05 18.16,49.53 19.3,48.39 | v25.02,45.85 25.04,45.83 C15.2 C15.1 | 24.24,38.34 C14.2 C14.1
  Top 0.254: 18.16,51.05 18.16,51.43 U1.9 | 24.24,38.34 24.24,37.57 JP2.1 | 19.3,48.39 19.43,48.26 v19.43,47.88
  Bottom 0.203: v19.43,47.88 19.69,48.13 21.34,48.13 21.97,47.5 21.97,46.86 22.99,45.85 v25.02,45.85
  Bottom 0.254: JP2.1 25.02,38.35 v25.02,45.85
MIC2-  (via drill 0.39)
  Top 0.203: C15.3 C15.6 | C15.6 C15.5 | C15.6 C15.7 | C15.6 C14.7 C14.6 C14.3 C14.4
  Top 0.254: v23.75,46.74 24.24,46.25 C15.3 | C14.4 25.94,36.73 JP2.2 | U1.10 18.97,49.74 v19.69,49.02
  Bottom 0.254: v19.69,49.02 21.08,49.02 23.37,46.74 v23.75,46.74
N$1
  Top 0.254: CHRG.C 9.73,58.56 R1.1
N$2
  Top 0.254: U2.1 14.16,55.56 13.84,55.25 11.68,55.25 11.3,55.63 11.3,58.23 R1.2 11.76,58.69 R2.2
N$3
  Top 0.254: X3.1 10.89,11.84 11.18,11.56 11.18,10.03 11.43,9.78 12.15,9.78 ATMEGA328.7
N$4
  Top 0.254: PWRSTAT.A 16.73,35.33 R4.1
N$5
  Top 0.254: R3.1 15.33,52.64 U2.5
N$6
  Top 0.254: DONE.A 9.82,60.41 R2.1
N$7
  Top 0.254: R7.1 32.38,17.57 U$38.PLUS
N$8
  Bottom 0.381: U$39.P$1 28.49,16.68 U$42.ANA 27.51,16.64 26.29,16.64 25.24,17.68 RFM12B.ANT
N$9
  Top 0.254: R5.1 28.35,66.39 NETSTAT.A
N$16
  Top 0.254: JP3.1 D3.A 32,71.12 32.95,70.17 Q1.C
N$20
  Top 0.381: C12.2 3.86,7 2.92,7.94 2.92,16.64 1.65,17.91 FTDI.6
N$21
  Top 0.254: ATMEGA328.8
  Top 0.305: X3.3 10.62,9.44 11.18,8.89 ATMEGA328.8
NETSTAT
  Top 0.152: 33.82,56.74 36.45,56.74
  Top 0.203: 36.45,56.74 36.45,44.7 | 33.82,56.74 33.13,57.44 U1.64
  Top 0.254: 36.45,44.7 36.45,43.94 35.58,43.07 IC1.12
NETSTAT_5V  (via drill 0.39)
  Top 0.254: JP1.2 32.51,32.26 | R5.2 29.59,69.53 29.59,69.85 v32,69.85 | v33.4,42.42 IC1.11
  Bottom 0.254: v32,69.85 32,67.95 32.89,67.06 32.89,65.79 34.23,64.45 34.23,47.69 32.13,45.59 32.13,42.42 32.77,41.78 | JP1.2 32.51,32.26 32.77,32.51 32.77,34.16 35.31,36.7 35.31,39.24 32.77,41.78 | 32.77,41.78 v33.4,42.42
PWM
  Top 0.254: U1.26 35.85,57.44 36.45,58.04 36.45,67.95 35.56,67.95 | 35.56,67.95 34.54,67.95 33.53,66.93 32.13,66.93 31.75,67.31 31.75,68.07 30.93,68.89 Q1.B | PWM.1 35.56,67.95
PWR  (via drill 0.38 pad 0.81)
  Top 0.381: v4.86,14.98 5.67,15.79 | 5.67,15.79 6.09,16.21 IC3.3 | C18.1 5.67,16.21 5.67,15.79
  Top 0.508: ANALOGSIDE.12 7.11,18.54 IC3.3
  Bottom 0.381: FTDI.3 3.17,12.07 3.17,13.21 4.99,15.02 v4.86,14.98
PWRKEY  (via drill 0.39)
  Top 0.152: v17.14,56.97 17.2,56.97 17.45,56.72 19.63,56.72 U1.48
  Top 0.254: D5.A 29.46,38.61 29.46,37.85 v29.08,37.47 | SW1.B' 12.28,72.1 v12.41,71.97 12.54,72.1 SW1.B
  Bottom 0.254: v12.41,71.97 12.41,70.27 14.99,67.69 16.76,67.69 18.29,66.17 18.29,58.12 v17.14,56.97 17.14,57.02 21.59,52.58 22.1,52.58 24.13,50.55 24.13,48.51 24.64,48.51 25.53,47.62 27.69,47.62 28.96,46.36 29.59,46.36 30.23,45.72 30.23,38.48 29.21,37.47 v29.08,37.47
PWRKEY_5V
  Top 0.254: JP1.6 22.86,32 24.13,33.27 26.03,33.27 26.54,33.78 27.94,33.78 29.59,35.43 D5.C
PWRSTAT  (via drill 0.39)
  Top 0.254: U1.4 17.11,58.84 v17.02,58.93 | v29.46,45.34 29.72,45.09 29.72,43.81 29.62,43.72 IC1.2
  Bottom 0.254: v17.02,58.93 17.02,57.91 16.38,57.28 16.38,56.64 17.14,55.88 17.53,55.88 21.46,51.94 21.97,51.94 23.62,50.29 23.62,48.26 23.88,48.01 24.38,48.01 25.27,47.12 27.05,47.12 28.83,45.34 v29.46,45.34
PWRSTAT_5V
  Top 0.254: IC1.3 28.68,43.05 27.81,43.05 27.3,42.55 27.3,40.64 28.32,39.62 28.32,34.92 27.69,34.29 26.29,34.29 25.78,33.78 23.75,33.78 23.24,33.27 21.59,33.27 20.32,32 JP1.7 19.69,32.13 19.69,34.73 19.11,35.31 R4.2
RESET  (via drill 0.39)
  Top 0.152: 19.57,55.32 17.4,55.32
  Top 0.203: 19.57,55.32 20.26,54.64 U1.49
  Top 0.254: 17.4,55.32 17.09,55.63 16.26,55.63 v16,55.88 | D6.A 34.54,38.1 v34.04,38.61
  Bottom 0.254: v16,55.88 16.6,55.28 17.34,55.28 21.44,51.18 21.97,51.18 23.11,50.04 23.11,47.75 23.37,47.5 24.13,47.5 25.02,46.61 26.54,46.61 27.69,45.47 27.69,39.62 28.19,39.12 28.19,36.32 28.32,36.2 31.62,36.2 v34.04,38.61
RESET_5V  (via drill 0.39)
  Top 0.254: v31.24,33.4 31.88,33.4 33.4,34.92 33.4,36.45 32.26,37.59 D6.C
  Bottom 0.254: JP1.8 17.78,32 19.05,33.27 23.24,33.27 23.75,33.78 27.81,33.78 28.19,33.4 v31.24,33.4
RI  (via drill 0.39)
  Top 0.152: U1.68 32.26,63.81 32.26,66.04
  Top 0.203: 32.26,66.04 33.27,66.04 34.29,67.06 v35.56,67.06
  Top 0.254: IC1.5 29.83,41.77 30.58,41.02 31.5,41.02 32.13,41.66 32.13,42.93 33.53,44.32 v33.53,45.09
  Bottom 0.203: 34.92,64.77 33.78,65.91 33.78,66.55 34.29,67.06 v35.56,67.06
  Bottom 0.254: v33.53,45.09 33.53,46.23 34.92,47.62 34.92,64.77
RI_5V
  Top 0.254: JP1.5 25.53,32 26.8,33.27 28.19,33.27 30.35,35.43 30.35,38.61 31.12,39.37 32.89,39.37 33.53,40.01 33.53,41.15 32.38,41.15 31.75,40.51 30.35,40.51 29.72,41.15 28.73,41.15 IC1.6
RST  (via drill 0.33, 0.33 pad 0.69)
  Top 0.305: DIGITALSIDE.13 1.4,1.92 C12.1 4.78,5.35 R6.2 6.43,7.54 5.97,8 4.06,8 3.76,8.31 3.76,11.81 v4.52,12.57
  Top 0.381: ATMEGA328.29 16.13,14.87 v15.88,14.61
  Bottom 0.305: v15.88,14.61 14.73,15.75 13.97,15.75 13.46,15.24 7.19,15.24 v4.52,12.57
RXD_5V
  Top 0.254: D4.C 32,35.31 29.97,33.27 JP1.3
SIMCLK  (via drill 0.39)
  Top 0.152: U1.55 25.27,51.24 v25.27,49.15
  Top 0.254: 25.27,49.53 v25.27,49.15 25.27,48.36 D2.4
  Bottom 0.254: X6.C3 26.65,66.19 28.45,64.39 31.5,64.39 32.38,63.5 32.38,50.42 31.37,49.4 27.3,49.4 26.67,50.04 26.16,50.04 v25.27,49.15
SIMDATA  (via drill 0.39)
  Top 0.203: U1.14 24.38,50.15 24.38,48.13 24.64,47.88
  Top 0.254: 24.64,47.88 25.02,47.5 D2.5 25.65,47.5 26.03,47.12 26.03,45.97 v26.16,45.85
  Bottom 0.254: X6.C7 26.39,45.62 v26.16,45.85
SIMRST  (via drill 0.39)
  Top 0.203: U1.15 25.97,49.59 26.23,49.34
  Top 0.254: 26.23,49.34 v26.41,49.15 26.41,49.02 D2.3
  Bottom 0.254: X6.C2 29.19,66.19 30.48,64.9 31.88,64.9 32.89,63.88 32.89,50.04 31.75,48.89 26.67,48.89 v26.41,49.15
SPEAKER1+  (via drill 0.39)
  Top 0.152: U1.53 23.88,51.23 23.88,49.53 23.75,49.4
  Top 0.254: 23.75,49.4 23.75,48.13 | 12.45,46.23 C11.2 12.57,45.65 v12.57,42.42
  Top 0.406: 23.75,48.13 22.23,46.61 22.23,38.73 20.95,37.47 v20.95,34.8
  Bottom 0.254: v20.95,34.8 18.54,34.8 12.57,40.77 v12.57,42.42
SPEAKER2+  (via drill 0.39)
  Top 0.152: U1.51 21.08,51.06 v21.08,47.37
  Top 0.254: C17.2 C17.1 17.78,40.01 v17.78,41.78 17.78,42.55 18.2,42.97 C16.1 C16.2 | 13.34,33.85 13.34,33.27 13.34,33.15
  Top 0.406: 13.34,33.15 JP1.10 | 13.34,33.27 13.34,36.83 15.66,39.16 C17.1
  Bottom 0.254: v21.08,47.37 20.07,47.37 17.78,45.09 v17.78,41.78
SPEAKER2-
  Top 0.254: C17.3 C17.6 | C17.6 C17.7 | C17.6 C17.5 C16.4 C16.3 C16.6 | C16.6 C16.7 | U1.11 20.37,49.86 20.45,49.78 20.45,48.13 20.32,48.01 20.32,44.68 C16.6
  Top 0.406: JP1.9 15.33,32.6 15.33,37.55 16,38.23 20.07,38.23 20.34,38.5 C17.3
TXD_5V
  Top 0.254: IC1.8 34.55,39.5 33.79,39.5 33.15,38.86 31.5,38.86 30.99,38.35 30.99,35.31 27.69,32 JP1.4
UART_RXD  (via drill 0.39)
  Top 0.203: 34.42,64.58 U1.31
  Top 0.254: v35.56,34.92 D4.A | 34.42,64.58 35.56,65.73 v35.56,65.91
  Bottom 0.203: 36.32,44.7 35.94,45.09 35.94,65.53 v35.56,65.91
  Bottom 0.254: 36.32,44.7 36.32,41.4 36.45,41.27 36.45,40.39 36.32,40.26 36.32,35.69 v35.56,34.92
UART_TXD  (via drill 0.39)
  Top 0.203: U1.32 32.97,65.48 | 34.54,65.41 34.54,65.48
  Top 0.254: IC1.9 35.46,41.12 v35.69,40.89 | 32.97,65.48 34.54,65.48 v34.54,66.17
  Bottom 0.203: v34.54,66.17 34.54,65.79 35.43,64.9 35.43,46.61
  Bottom 0.254: 35.43,46.61 35.43,41.15 v35.69,40.89
VBAT  (via drill 0.39)
  Top 0.254: D3.C JP3.2 | C6.1 13.97,68.93 v13.97,70.61
  Top 0.406: 8.89,64.01 8.89,64.26 | 12.07,66.8 CN2.2 | 13.59,61.22 13.84,61.22 12.83,60.2 12.83,57.66 12.29,57.12 12.26,57.12 U2.3
  Top 0.61: 8.89,64.01 10.16,62.74 12.07,62.74 13.59,61.22 | 12.07,66.8 9.4,66.8 8.89,66.29 8.89,64.26 8.76,64.39 v8,64.39 | 13.84,61.22 C7.1
  Top 0.813: U1.1 18.57,64.14 U1.42 18.4,65.11 C5.1 18.2,66.67 15.95,66.67 | C6.1 14.12,66.67 | 14.12,66.67 14.12,66.53 CN2.2 | D1.C 15.75,66.67 14.12,66.67
  Top 1.016: D1.C 15.95,66.67
  Bottom 0.254: v13.97,70.61 13.97,69.98 15.37,68.58 16.64,68.58 18.8,66.42 18.8,62.74 25.02,62.74 25.4,63.12 25.4,67.18 25.78,67.56 29.72,67.56 30.71,68.56 30.71,71.78 JP3.2
  Bottom 0.61: JP1.12 5.71,33.4 5.71,38.99 6.86,38.99 6.86,44.32 5.71,44.32 5.71,62.1 v8,64.39
VCCIO  (via drill 0.39)
  Top 0.254: v34.41,45.97 v34.42,45.97 34.55,45.84 IC1.14
  Bottom 0.254: JP1.1 33.78,33.27 33.78,34.42 35.81,36.45 35.81,39.5 34.67,40.64 34.67,42.8 34.42,43.05 v34.42,45.97
VIO  (via drill 0.33)
  Top 0.305: ATMEGA328.4 14.08,12.08 14.35,11.81 14.35,10.8 14.03,10.48 13.84,10.48 | ATMEGA328.6 13.84,10.48 | v25.27,12.45 24.64,13.08 W25X40CLSNIG-ND.8 | v25.27,12.45 25.91,13.08 W25X40CLSNIG-ND.7 | v25.27,12.45 25.27,11.18 25.78,10.67 26.29,10.67 27.18,9.78 W25X40CLSNIG-ND.3 | v23.11,15.62 24.24,15.62 24.64,15.22 | 13.72,10.36 13.84,10.48 | R6.1 6.43,5.32 C13.1
  Top 0.381: 24.64,15.22 W25X40CLSNIG-ND.8 | ATMEGA328.18 17.18,9.68 16.38,8.89 13.72,8.89 | 13.72,8.89 13.72,10.36 | C13.1 9.03,6.97 9.78,6.22 11.05,6.22 13.72,8.89
  Top 0.457: ATMEGA328.18 23.21,9.68 v23.11,9.65
  Top 0.508: 7.87,7.07 C13.1 7.87,7.07 | C19.1 6.24,11.03 7.22,11.03 7.24,11.05 | 7.87,7.07 7.87,7.87 7.24,8.51 7.24,11.05 | 7.24,11.05 7.24,12.57 8,13.34 8,13.95 IC3.2 | IC3.2 8.23,13.84 | ANALOGSIDE.11 6.48,20.52 U$42.VDD 8.31,14.26 IC3.2
  Top 0.635: 8.23,13.73 8.23,13.84
  Bottom 0.381: RFM12B.VDD 23.18,15.68 v23.11,15.62
  Bottom 0.457: +.1 31.75,11.56 29.46,13.84 26.03,13.84 25.18,12.99 25.18,12.54 v25.27,12.45 25.27,11.18 23.75,9.65 v23.11,9.65 | U$42.VDD 8.31,19.88 ANALOGSIDE.11
VRTC
  Top 0.152: 27.37,51.75 27.99,51.13 29.39,51.13 29.46,51.05 29.46,49.59
  Top 0.203: U1.56 27.37,51.75 | 32,48.39 C9.1 32,48.51 31.62,48.89 30.16,48.89 29.46,49.59

### Text on the board
tPlace: Key | PWM | Net | 5V | ADC | 2.8V | Mic | PWR | + | - | Bat | GND | Key | + | SPKR | Rst | PS | RI | TX | RX | NS | Vio | - | R4 | MOTEINO | .com
bPlace: Buzzer | + | - | adafruit! | 3.7V LiPoly / 0.5A charge | USB Charging | Only | FONA MiniGSM | Cell-phone / Data/SMS | 2G GSM / SIM Card | TRRS: / LR-M | Vio: I/O Level 3-5VDC | RFM12B / XTAL | LowPowerLab | RFM69 / XTAL
tDocu: REG
sName: VIN | 3.3 | 1 | 0 | A7 | A6 | A5 | A4 | A3 | A2 | A1 | GND | A0 | DTR | TX | RX | SCL | SDA | ANT | GND | 3.3 | ATMEGA / 328 | FLASH | MEM | AR | FTDI | GND | ~ | 2 | ~ | 3 | 4 | ~ | 5 | ~ | 6 | 7 | 8 | ~ | 9 | ~ | 10 | MO | 11 | MI | 12 | SK | 13 | RST
_bPlace: VIN | 3.3 | 1 | 0 | A7 | A6 | A5 | A4 | A3 | A2 | A1 | A0 | GND | DTR | ANT | VIN | GND | 2 | 3 | 4 | 5 | 6 | 7 | 8 | 9 | 10 | 11 | 12 | 13 | RST